# Altium schematic sheet Top Level.SchDoc
size Letter; SheetNumber: 1; SheetTotal: 1
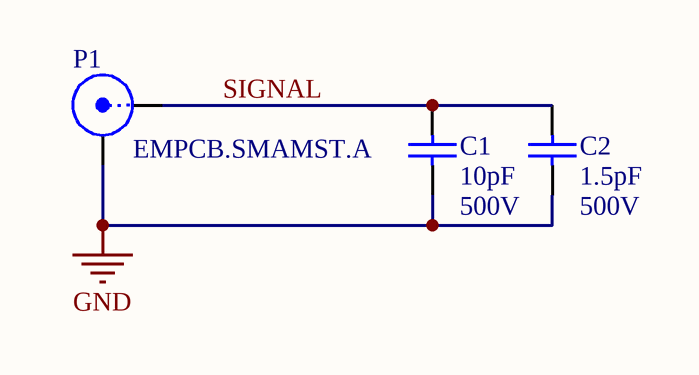
[diagram p0: Top Level.SchDoc]

## Parts
C1  value 10pF  Voltage: 500V  [CAP_1111_ATC 800B]  (hidden comment: 800B100JT500XT1K)
C2  value 1.5pF  Voltage: 500V  [CAP_1111_ATC 800B]  (hidden comment: 800B1R5BT500XT1K)
P1  EMPCB.SMAMST.A  [FP-EMPCB.SMAMST.A]

## Nets
GND: C1.1 C2.1 P1.2(SHELL)
SIGNAL: C1.2 C2.2 P1.1

## Notes on the sheet
- Title:
- Desc:
- Size:
- Letter
- Auth:
- Sheet
- of
- www.seas.upenn.edu
- Electrical and Systems Engineering
- Proj:

## Library data of the parts
C1 = CMP-001-00027-1: Ceramic Capacitor, Multilayer, Ceramic, 500V, 5% +Tol, 5% -Tol, C0G, 30ppm/Cel TC, 0.00001uF, Surface Mount, 1111; Min Operating Temperature: -55°C; Lifecycle Status: Production; Voltage Rating (DC): 500V; Max Operating Temperature: 125°C; Width: 2.79mm; Number of Terminals: 2; Height: 1.78mm; Mounting Technology: Surface Mount; RoHS: Compliant; Mount: SMD; Capacitor Type: Ceramic; China RoHS: Compliant; REACH SVHC: Yes; Length: 2.79mm; Case/Package: 1111; Dielectric Material: Ceramic
C2 = CMP-001-00043-1: Ceramic Capacitor, Multilayer, Ceramic, 500V, 33.3333% +Tol, 33.3333% -Tol, C0G, 30ppm/Cel TC, 0.0000015uF, Surface...; Max Operating Temperature: 125°C; Dielectric Material: Ceramic; Width: 2.79mm; Mounting Technology: Surface Mount; China RoHS: Compliant; Mount: SMD; Capacitor Type: Ceramic; Number of Terminals: 2; Voltage Rating (DC): 500V; Length: 2.79mm; Height: 1.78mm; RoHS: Compliant; Lifecycle Status: Production; Case/Package: 1111; REACH SVHC: Yes; Min Operating Temperature: -55°C
P1 = CMP-00823-1: Rf Coax Connector, Sma Plug, 50 Ohm, Edge Mnt; SMA Plug; RoHS: Compliant